# EAGLE design MACS7 (EAGLE 6.6.0)
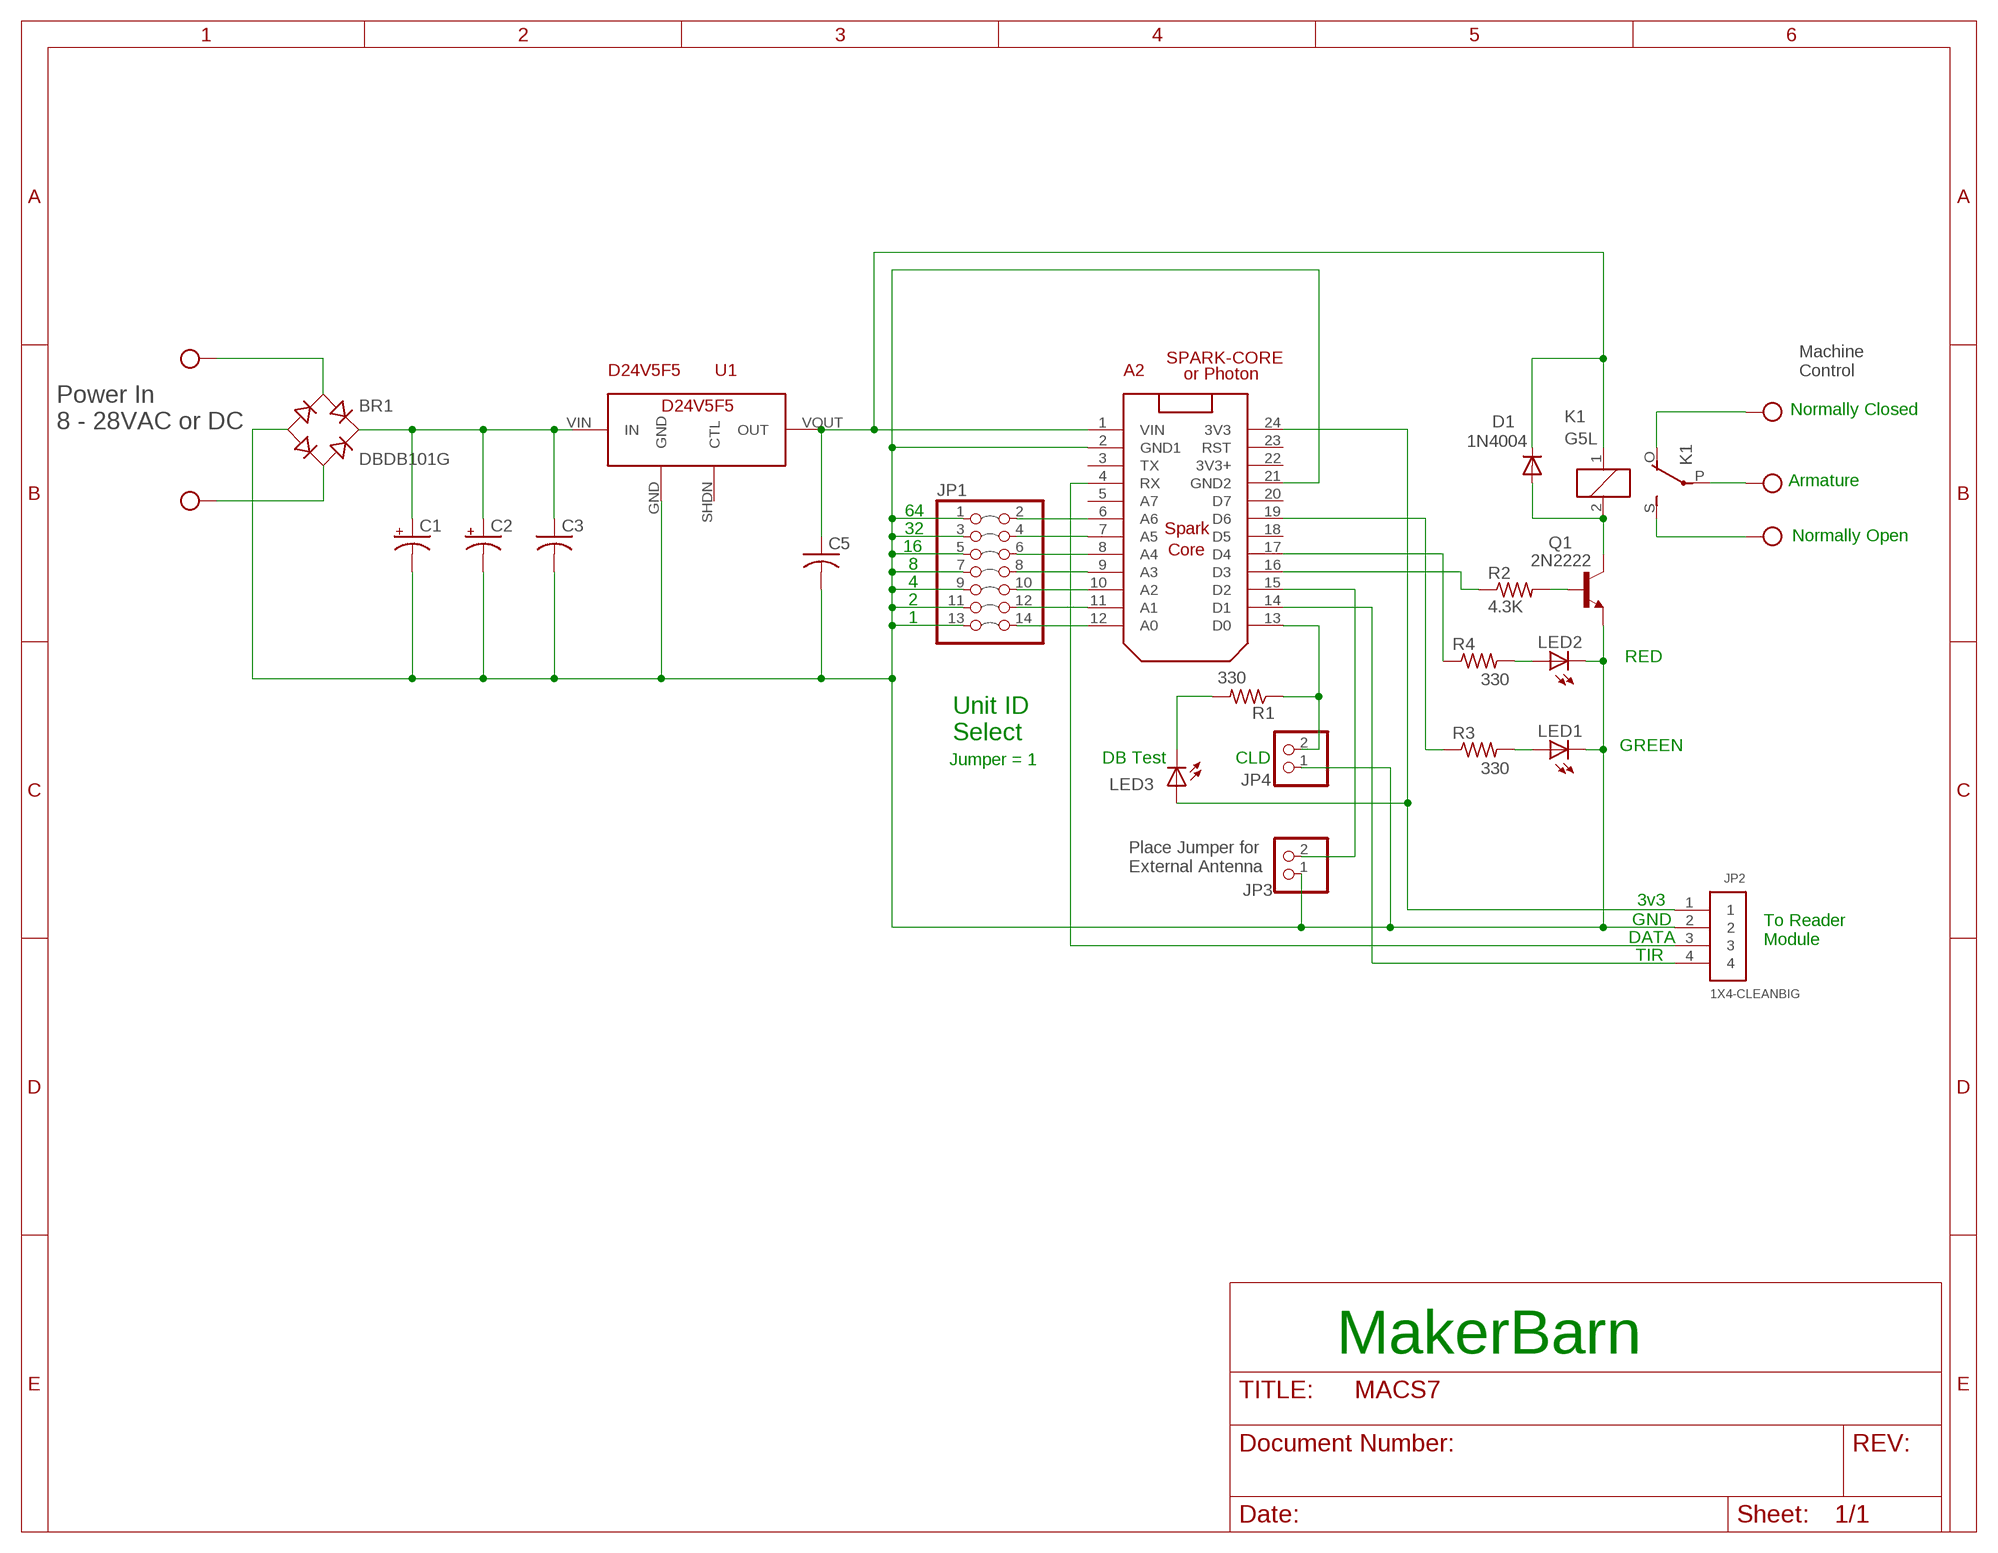
[diagram p0: schematic, sheet 1]

## Parts
A2  SPARK-CORE  [SPARK-CORE]
BR1  DBDB101G  [DB]
C1  CPOL-USE35-16AXIAL  [E35-16]
C2  CPOL-USE35-16AXIAL  [E35-16]
C3  C-US050-035X075  [C050-035X075]
C5  C-US050-035X075  [C050-035X075]
D1  1N4004  [DO41-10]
JP1  PINHD-2X7  [2X07]
JP2  1X4-CLEANBIG  [1X04-CLEANBIG]
JP3  PINHD-1X2  [1X02]
JP4  PINHD-1X2  [1X02]
K1  G5L  [G5LE]
LED1  LED5MM  [LED5MM]
LED2  LED5MM  [LED5MM]
LED3  LED3MM  [LED3MM]
Q1  2N2222  [TO92-EBC-OVAL]
R1  330  R-US_R0805  [R0805]
R2  4.3K  R-US_R0805  [R0805]
R3  330  R-US_R0805  [R0805]
R4  330  R-US_R0805  [R0805]
U1  D24V5F5  [POLOLUREG]
X2  MKDSN1,5/2-5,08  [MKDSN1,5/2-5,08]
X3  MKDSN1,5/3-5,08  [MKDSN1,5/3-5,08]

## Nets
3V3: A2.24(3V3) JP2.1 LED3.A
DATA: A2.4(RX) JP2.3
GND: A2.2(GND1) A2.21(GND2) BR1.- C1.- C2.- C3.2 C5.2 JP1.1 JP1.3 JP1.5 JP1.7 JP1.9 JP1.11 JP1.13 JP2.2 JP3.1 JP4.1 LED1.K(C) LED2.K(C) Q1.E U1.GND
N$1: K1.P(2:P) X3.1
N$6: A2.16(D3) R2.1
N$8: A2.6(A6) JP1.2
N$9: BR1.AC2 X2.2
N$10: A2.1(VIN) C5.1 D1.C K1.1 U1.VOUT(OUT)
N$12: BR1.AC1 X2.1
N$13: A2.17(D4) R4.1
N$14: A2.19(D6) R3.1
N$15: LED2.A R4.2
N$16: LED1.A R3.2
N$17: K1.O(2:O) X3.2
N$18: Q1.B R2.2
N$19: A2.7(A5) JP1.4
N$20: D1.A K1.2 Q1.C
N$21: BR1.+ C1.+ C2.+ C3.1 U1.VIN(IN)
N$22: K1.S(2:S) X3.3
N$23: A2.8(A4) JP1.6
N$24: A2.9(A3) JP1.8
N$25: A2.10(A2) JP1.10
N$26: A2.11(A1) JP1.12
N$27: A2.12(A0) JP1.14
N$28: A2.15(D2) JP3.2
N$29: A2.13(D0) JP4.2 R1.1
N$30: LED3.K(C) R1.2
TIR: A2.14(D1) JP2.4
Unconnected: A2.3(TX) A2.5(A7) A2.18(D5) A2.20(D7) A2.22(3V3+) A2.23(RST) U1.SHDN(CTL)

## Notes on the sheet
- Machine
  Control
- or Photon
- Normally Closed
- Power In
  8 - 28VAC or DC
- Armature
- 64
- 32
- Normally Open
- 16
- 8
- 4
- 2
- 1
- RED
- Unit ID
  Select
- GREEN
- Jumper = 1 | DB Test | CLD
- Place Jumper for
  External Antenna
- 3v3
- GND
- DATA
- To Reader
  Module
- TIR
- MakerBarn

## Library data of the parts
A2 = George Special:SPARK-CORE
BR1 = rectifier:DB?*G: Single Phase 1.0 AMP Glass Passivated Bridge Rectifier Taiwan Semiconductor Co.,Ltd. - TSC Source: http://www.taiwansemi.com/TSCbig5/ezcatfiles/cust/img/img/db101g.pdf http://www.ts.com.tw/db/pictures/modules/PDT/PDT060207001/DBLS201G.pdf
C1 C2 = adafruit:CPOL-US: POLARIZED CAPACITOR, American symbol
C3 C5 = adafruit:C-US: CAPACITOR, American symbol
D1 = adafruit:1N4004: DIODE General purpose 1N400x type rectifier (With bigger pads) http://www.ladyada.net/library/pcb/eaglelibrary.html
JP1 = pinhead:PINHD-2X7: PIN HEADER
JP2 = adafruit:1X4: 4-pin connector
JP3 JP4 = pinhead:PINHD-1X2: PIN HEADER
K1 = relay:G5L: RELAY 1 x switch, 10 A/120 V AC, 8 A/30 V ADC, Omron; OC_FARNELL: unknown; OC_NEWARK: unknown
LED1 LED2 = led:LED: LED
LED3 = adafruit:LED: LED
Q1 = adafruit:2N2222: NPN TRANSISTOR Big oval pads
R1-R4 = adafruit:R-US_: RESISTOR, American symbol
U1 = George Special:D24V5F5
X2 = con-phoenix-508:MKDSN1,5/2-5,08: MKDSN 1,5/ 2-5,08 Printklemme Nennstrom: 13,5 A Nennspannung: 250 V Rastermaß: 5,08 mm Polzahl: 2 Anschlussart: Schraubanschluss Montage: Löten Anschlussrichtung Leiter/Platine: 0 ° Artikelnummer: 1729128 Source: http://eshop.phoenixcontact.com .. 1729128.pdf
X3 = con-phoenix-508:MKDSN1,5/3-5,08: MKDSN 1,5/ 3-5,08 Printklemme Nennstrom: 13,5 A Nennspannung: 250 V Rastermaß: 5,08 mm Polzahl: 3 Anschlussart: Schraubanschluss Montage: Löten Anschlussrichtung Leiter/Platine: 0 ° Artikelnummer: 1729131 Source: http://eshop.phoenixcontact.com .. 1729131.pdf

## Board
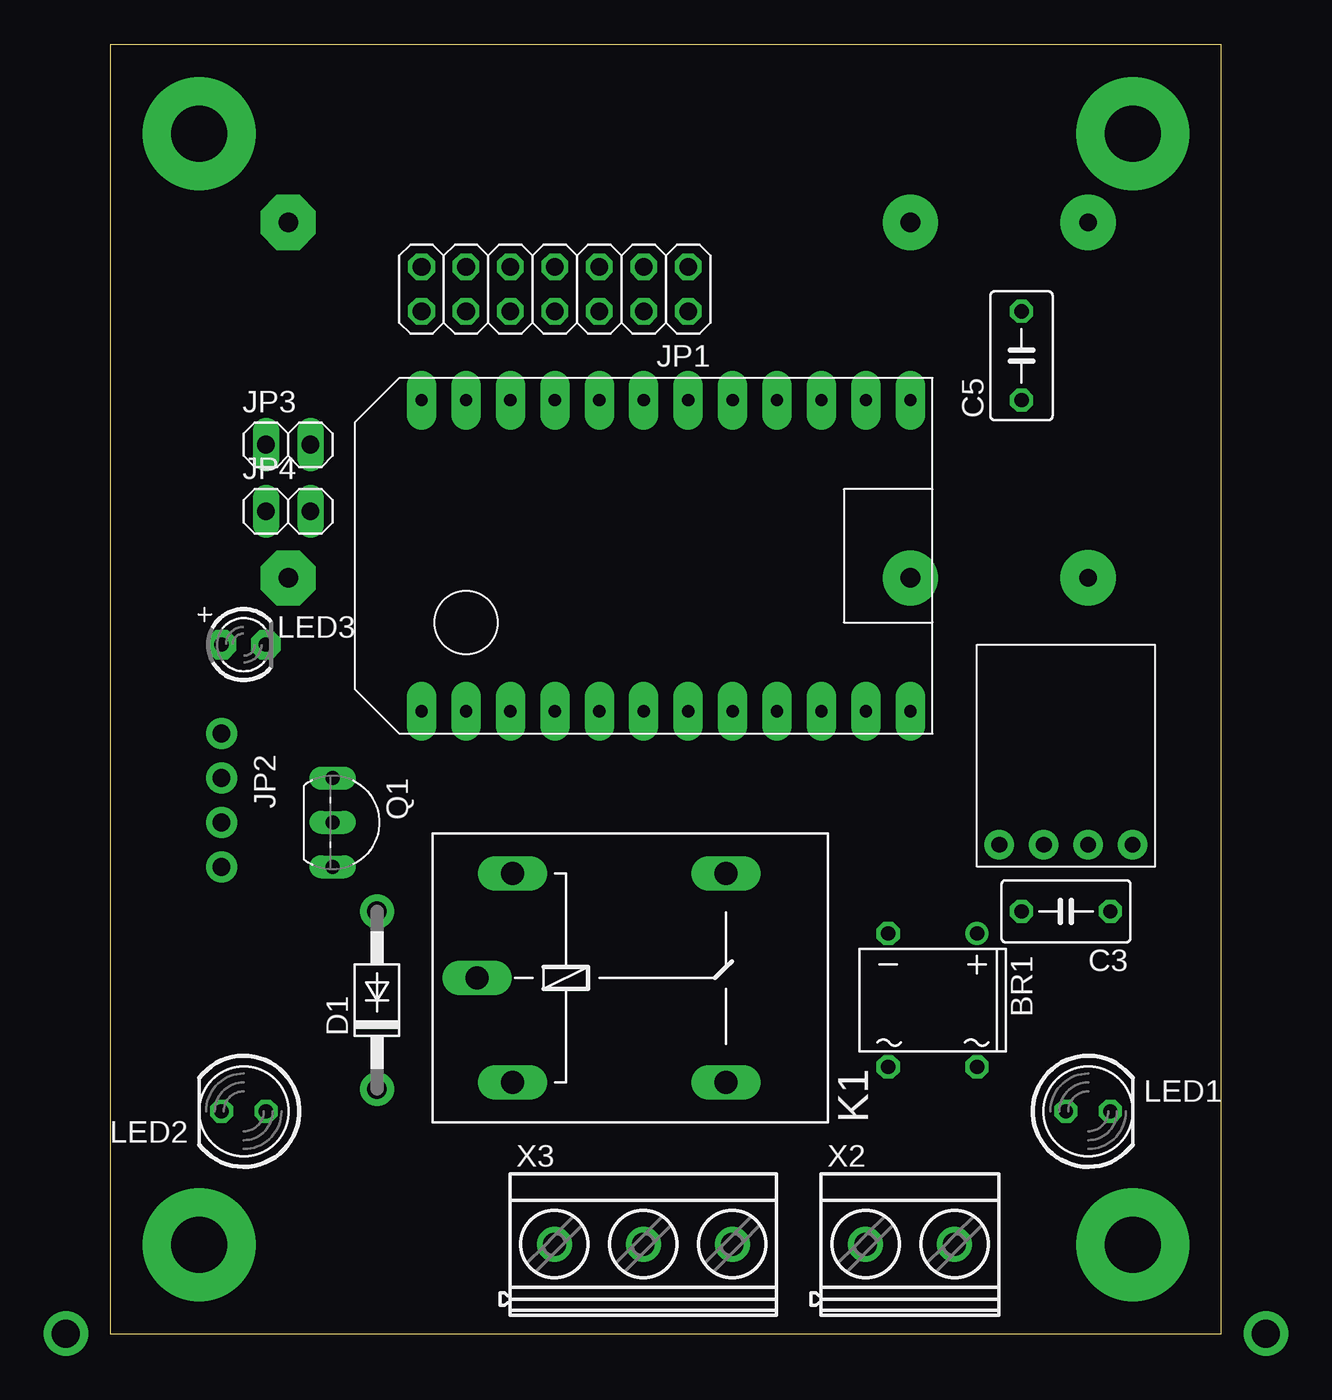
[diagram p1: board, top side]
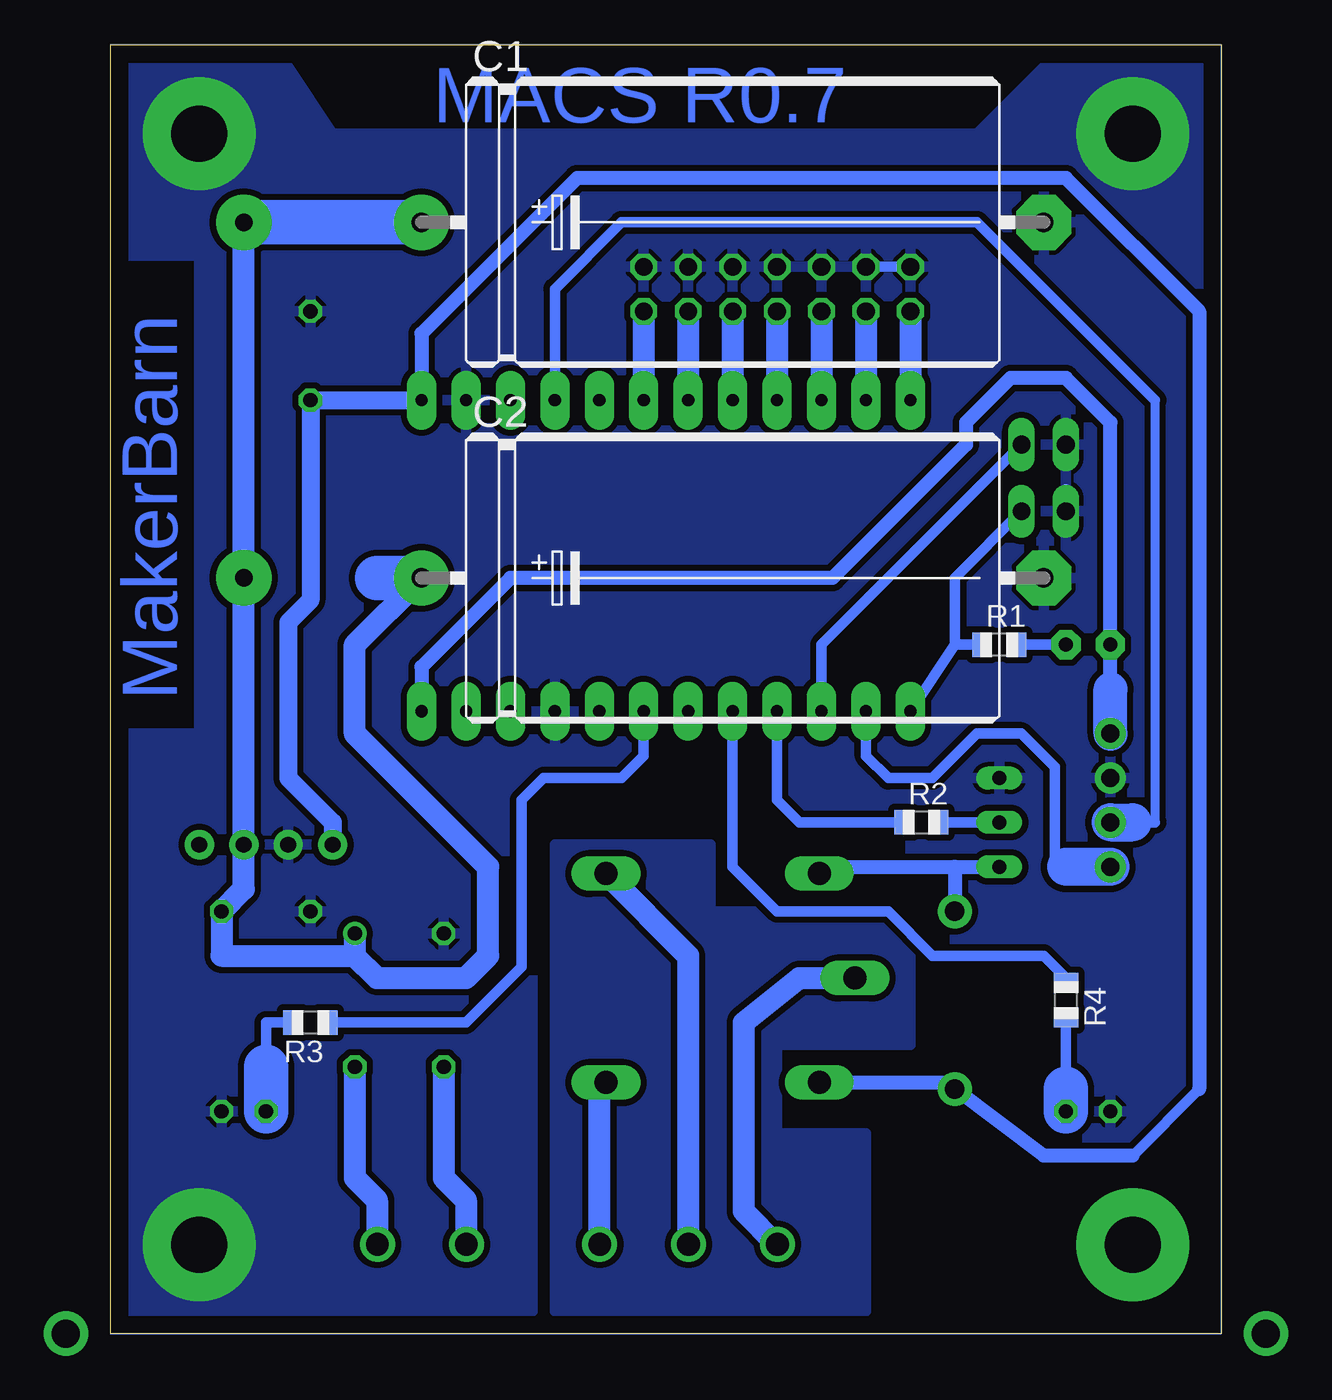
[diagram p2: board, bottom side, seen from below]

Size 63.48 x 73.66 mm. Coordinates in mm from the lower left corner, seen from the top.
Outline: 0,0 63.48,0 63.48,73.66 0,73.66 0,0
Copper layers (1*16): Top 0.035mm / dielectric 1.5mm / Bottom 0.035mm
Design rules "default *": minimum track width 0.6mm, minimum drill 24mil, track to track 0.35mm, track to pad 0.4mm, pad to pad 0.4mm, via to via 8mil, smd to smd 8mil, copper to edge 40mil, drill to drill 8mil, minimum pad ring 10mil, minimum via ring 8mil, stop-mask expansion 4mil, vias tented up to drill 0mil, thermal gap 10mil

### Footprints (pad centres in the part's own frame; a part is rotated, then mirrored left to right if it is on the bottom)
SPARK-CORE = drill 0.7 pad 1.676 long: 1 0,0; 2 0,-2.54; 3 0,-5.08; 4 0,-7.62; 5 0,-10.16; 6 0,-12.7; 7 0,-15.24; 8 0,-17.78; 9 0,-20.32; 10 0,-22.86; 11 0,-25.4; 12 0,-27.94; 13 17.78,-27.94; 14 17.78,-25.4; 15 17.78,-22.86; 16 17.78,-20.32; 17 17.78,-17.78; 18 17.78,-15.24; 19 17.78,-12.7; 20 17.78,-10.16; 21 17.78,-7.62; 22 17.78,-5.08; 23 17.78,-2.54; 24 17.78,0
DB = drill 0.813: + -2.54,-3.81 | drill 0.813 octagon: - 2.54,-3.81; AC1 2.54,3.81; AC2 -2.54,3.81
E35-16 = drill 1.118 pad 3.15: + -17.78,0 | drill 1.118 pad 3.15 octagon: - 17.78,0
C050-035X075 = drill 0.813 octagon: 1 -2.54,0; 2 2.54,0
DO41-10 = drill 1.118 pad 1.93: A 5.08,0; C -5.08,0
2X07 = drill 1.016 octagon: 1 -7.62,-1.27; 2 -7.62,1.27; 3 -5.08,-1.27; 4 -5.08,1.27; 5 -2.54,-1.27; 6 -2.54,1.27; 7 0,-1.27; 8 0,1.27; 9 2.54,-1.27; 10 2.54,1.27; 11 5.08,-1.27; 12 5.08,1.27; 13 7.62,-1.27; 14 7.62,1.27
1X04-CLEANBIG = drill 1.016 pad 1.778: 1 -3.81,0; 2 -1.27,0; 3 1.27,0; 4 3.81,0
1X02 = drill 1.016 long: 1 -1.27,0; 2 1.27,0
G5LE = drill 1.321 long: 1 -7.493,-5.969; 2 -7.493,5.969; O 4.699,5.969; P -9.525,0; S 4.699,-5.969
LED5MM = drill 0.813 octagon: A -1.27,0; K 1.27,0
LED3MM = drill 0.813 pad 1.676 octagon: A -1.27,0; K 1.27,0
TO92-EBC-OVAL = drill 0.813 long: B 0,-1.27; C 2.54,-1.27; E -2.54,-1.27
R0805 = smd 1.1 x 1.4: 1 -1,0; 2 1,0
POLOLUREG = drill 0.9 pad 1.676: GND 2.54,0; SHDN 7.62,0; VIN 5.08,0; VOUT 0,0
MKDSN1,5/2-5,08 = drill 1.3 pad 2: 1 -2.561,0.025; 2 2.519,0.025
MKDSN1,5/3-5,08 = drill 1.3 pad 2: 1 -7.641,0.025; 2 -2.561,0.025; 3 2.519,0.025

### Placement (x,y rotation side)
A2  45.72,53.34 270 top
BR1  46.99,19.05 180 top
C1  27.94,63.5 0 bottom
C2  27.94,43.18 0 bottom
C3  54.61,24.13 180 top
C5  52.07,55.88 90 top
D1  15.24,19.05 90 top
JP1  25.4,59.69 180 top
JP2  6.35,30.48 270 top
JP3  10.16,50.8 0 top
JP4  10.16,46.99 0 top
K1  30.48,20.32 0 top
LED1  55.88,12.7 0 top
LED2  7.62,12.7 180 top
LED3  7.62,39.37 0 top
Q1  13.97,29.21 270 top
R1  12.7,39.37 0 bottom
R2  17.14,29.21 0 bottom
R3  52.07,17.78 180 bottom
R4  8.89,19.05 270 bottom
U1  50.8,27.94 0 top
X2  45.72,5.08 0 top
X3  33.02,5.08 0 top

### Tracks (layer width: path | path; a pad name or v marks a point on that pad's centre or on a via)
3V3
  Bottom 0.61: JP2.1 6.35,37.83
  Bottom 0.813: 6.35,36.83 LED3.A 6.35,52.07 8.89,54.61 12.07,54.61 14.61,52.07 14.61,50.8 22.23,43.18 40.64,43.18 45.72,38.1 A2.24
  Bottom 1.93: JP2.1 6.35,36.83
DATA
  Bottom 0.508: 3.81,53.34 3.81,29.21
  Bottom 0.61: 3.81,53.34 13.97,63.5 34.29,63.5 38.1,59.69 A2.4 | 3.81,29.21 5.08,29.21
  Bottom 2.184: JP2.3 5.08,29.21
GND  (via drill 3.2 pad 6.45)
  Bottom 0.6: JP1.11 JP1.13 | JP4.1 | 8.89,48.26 JP4.1 | C2.-
  other vias: 5.08,68.58 58.42,68.58 58.42,5.08
  pour Bottom: 1.27,1.27 1.27,72.39 10.16,72.39 13.97,68.58 50.8,68.58 53.34,72.39 63.5,72.39 63.5,61.59 58.42,61.59 58.42,34.29 63.5,34.29 63.5,1.27 39.37,1.27 39.37,29.21 17.78,29.21 17.78,25.4 15.24,25.4 15.24,1.27
N$1
  Bottom 0.6: 25.4,5.08 X3.1
  Bottom 1.27: K1.P 24.13,20.32 27.3,17.78 27.3,6.99 25.4,5.08
N$4  (via drill 3.2 pad 6.45)
  other vias: 5.08,5.08
N$6
  Bottom 0.61: R2.1 24.13,29.21 25.4,30.48 A2.16
N$7
  pour Bottom: 20.32,1.27 20.32,11.43 25.4,11.43 25.4,16.51 17.78,16.51 17.78,24.13 29.21,24.13 29.21,27.94 38.1,27.94 38.1,1.27
N$8
  Bottom 1.27: JP1.2 A2.6
N$9
  Bottom 0.813: 48.26,5.13 X2.2
  Bottom 1.27: BR1.AC2 49.53,8.89 48.26,7.62 48.26,5.13
N$10
  Bottom 0.61: 1.27,13.97 5.08,10.16 | 15.24,14.35 D1.C
  Bottom 0.813: D1.C 10.16,10.16 5.08,10.16 | 1.27,13.97 1.27,58.42 8.89,66.04 36.83,66.04 45.72,57.15 A2.1 | K1.1 15.24,14.35
  Bottom 1.016: U1.VOUT 50.8,29.21 53.34,31.75 53.34,40.64 52.07,41.91 C5.1 A2.1
N$11
  Bottom 0.051: 0,0 0,73.66 63.5,73.66 63.5,0 0,0
N$12
  Bottom 0.813: 43.18,5.13 X2.1
  Bottom 1.27: BR1.AC1 44.45,8.89 43.18,7.62 43.18,5.13
N$13
  Bottom 0.61: R4.1 8.89,20.32 10.16,21.59 16.51,21.59 19.05,24.13 25.4,24.13 27.94,26.67 A2.17
N$14
  Bottom 0.61: R3.1 43.18,17.78 40.01,20.95 40.01,30.48 38.73,31.75 34.29,31.75 33.02,33.02 A2.19
N$15
  Bottom 0.61: 8.89,13.97 R4.2
  Bottom 2.54: LED2.A 8.89,13.97
N$16
  Bottom 0.61: 54.61,15.24 54.61,17.78 R3.2
  Bottom 2.54: LED1.A 54.61,15.24
N$17
  Bottom 0.6: X3.2 30.48,5.08 30.48,5.13
  Bottom 1.27: K1.O 30.48,21.59 30.48,5.13
N$18
  Bottom 0.61: R2.2 Q1.B
N$19
  Bottom 1.27: JP1.4 A2.7
N$20
  Bottom 0.813: 15.24,26.67 22.86,26.67 K1.2 | 15.24,26.67 Q1.C | 15.24,26.67 D1.A
N$21  (via drill 1 pad 3.17)
  Bottom 1.27: v55.88,63.5 v55.88,43.18 U1.VIN 55.88,25.4 C3.1 57.15,21.59 49.53,21.59 | BR1.+ 49.53,21.59 | 49.53,21.59 48.26,20.32 43.18,20.32 41.91,21.59 41.91,26.67 49.53,34.29 49.53,39.37 C2.+
  Bottom 2.54: C1.+ v55.88,63.5 | C2.+ 48.26,43.18
N$22
  Bottom 0.6: 35.56,5.08 X3.3
  Bottom 1.27: 35.56,5.08 35.56,13.97 K1.S
N$23
  Bottom 1.27: JP1.6 A2.8
N$24
  Bottom 1.27: JP1.8 A2.9
N$25
  Bottom 1.27: JP1.10 A2.10
N$26
  Bottom 1.27: JP1.12 A2.11
N$27
  Bottom 1.27: JP1.14 A2.12
N$28
  Bottom 0.61: JP3.2 22.86,39.37 A2.15
N$29
  Bottom 0.61: JP4.2 15.24,43.18 15.24,39.37 | 15.24,39.37 A2.13 | R1.1 15.24,39.37
N$30
  Bottom 0.61: LED3.K R1.2
N$31  (via drill 1.6 pad 2.54)
  other vias: -2.54,0
N$32  (via drill 1.6 pad 2.54)
  other vias: 66.04,0
TIR
  Bottom 0.61: 8.89,26.67 9.52,26.67 9.52,32.38 11.43,34.29 13.97,34.29 16.51,31.75 19.05,31.75 20.32,33.02 A2.14
  Bottom 2.184: JP2.4 8.89,26.67

### Text on the board
Bottom: MACS R0.7 | MakerBarn